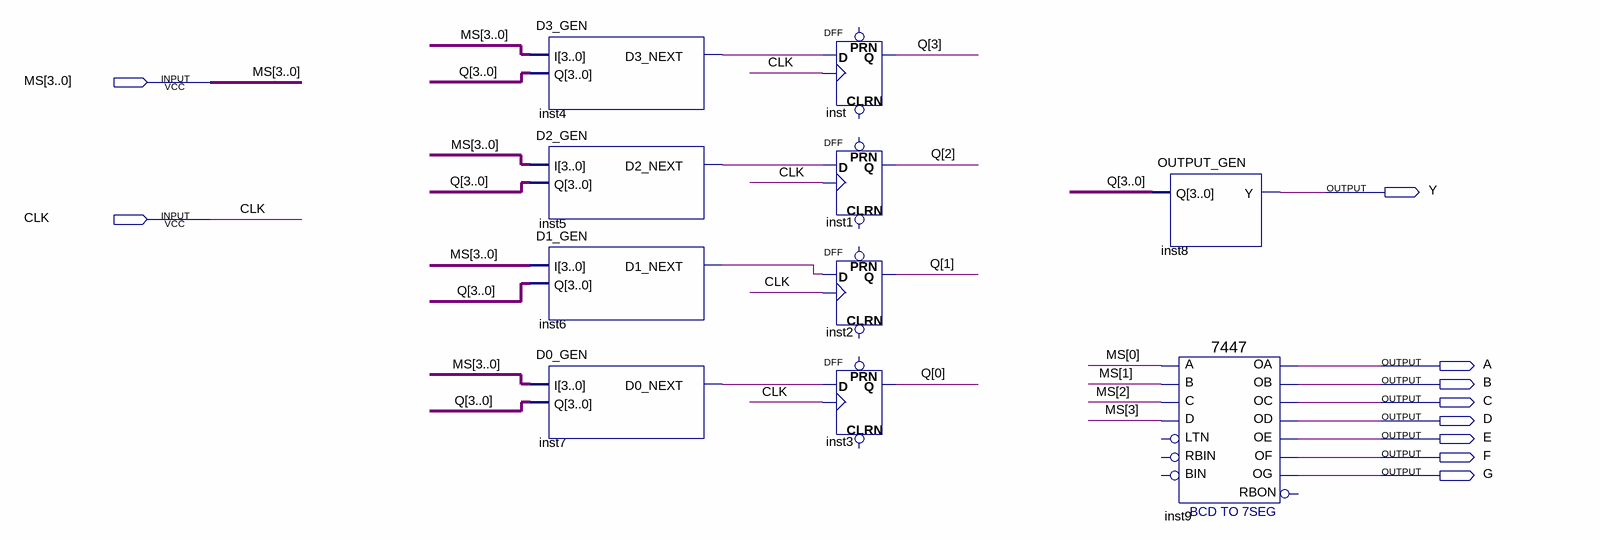
[diagram p0: schematic sheet]
// Quartus schematic MSSV_Detection.bdf as structural Verilog: 10 symbols, 10 pins
module MSSV_Detection (
  input  [3:0] MS,
  input  CLK,
  output Y,
  output A,
  output B,
  output C,
  output D,
  output E,
  output F,
  output G
);

  wire inst4_d3_next, inst5_d2_next, inst6_d1_next, inst7_d0_next;
  wire [3:0] Q;

  D3_GEN inst4 (.I(MS), .Q(Q), .D3_NEXT(inst4_d3_next));
  D2_GEN inst5 (.I(MS), .Q(Q), .D2_NEXT(inst5_d2_next));
  D1_GEN inst6 (.I(MS), .Q(Q), .D1_NEXT(inst6_d1_next));
  D0_GEN inst7 (.I(MS), .Q(Q), .D0_NEXT(inst7_d0_next));
  DFF inst (.CLK(CLK), .D(inst4_d3_next), .Q(Q[3]));  // open: CLRN, PRN
  DFF inst1 (.CLK(CLK), .D(inst5_d2_next), .Q(Q[2]));  // open: CLRN, PRN
  DFF inst2 (.CLK(CLK), .D(inst6_d1_next), .Q(Q[1]));  // open: CLRN, PRN
  DFF inst3 (.CLK(CLK), .D(inst7_d0_next), .Q(Q[0]));  // open: CLRN, PRN
  OUTPUT_GEN inst8 (.Q(Q), .Y(Y));
  \7447  inst9 (
    .B(MS[1]), .C(MS[2]), .D(MS[3]), .A(MS[0]), .OB(B), .OC(C), .OE(E), .OD(D), .OF(F), .OG(G), .OA(A));  // open: LTN, RBIN, BIN, RBON
endmodule
